# Altium project Yukitora.PrjPcb (part 4 of 5)

## Sheet Bluetooth.SchDoc
size Tabloid; Organization: Altium Limited; Address1: L3, 12a Rodborough Rd; Address2: Frenchs Forest; Address3: NSW; Address4: Australia 2086
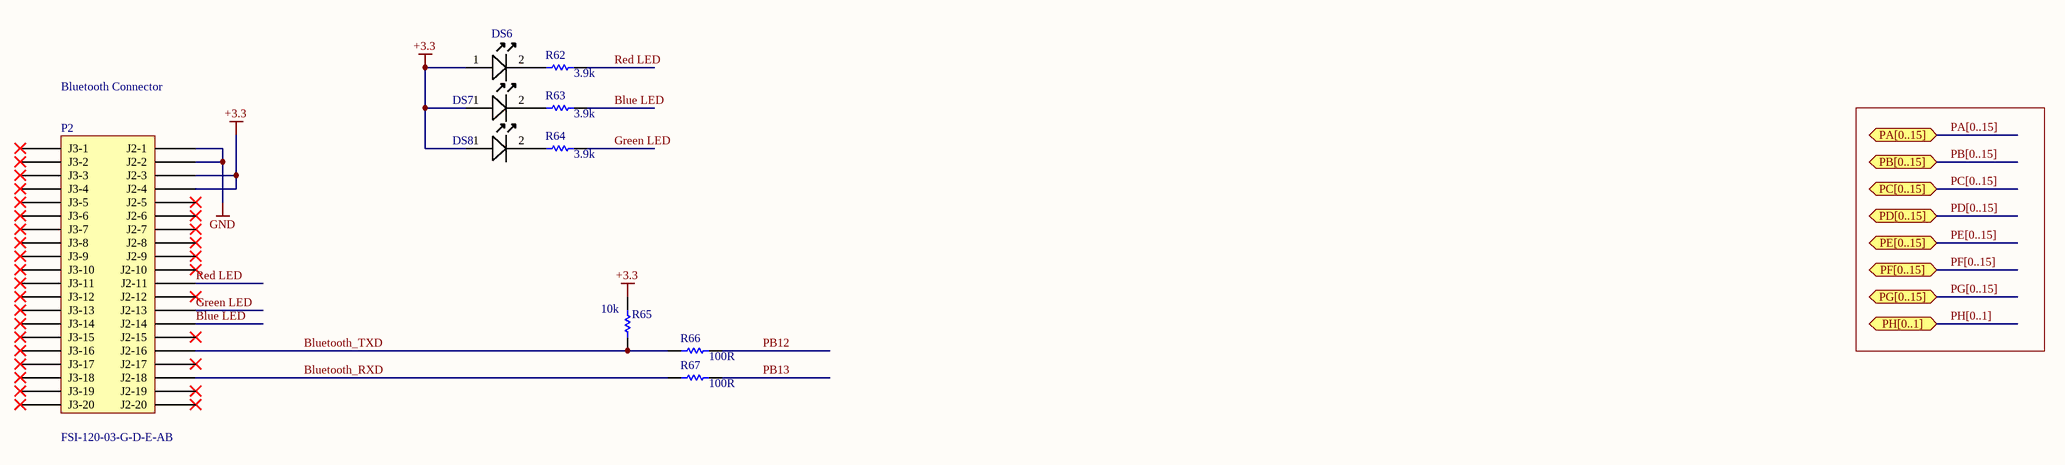
[diagram p8: Bluetooth.SchDoc]

### Parts
DS6  Lite-On LTST-S220KGKT Green LED, 571 nm 2012 (0805) Side View, Rectangle Lens SMD package  [0805C_L]  (value not drawn)
DS7  Lite-On LTST-S220KGKT Green LED, 571 nm 2012 (0805) Side View, Rectangle Lens SMD package  [0805C_L]  (value not drawn)
DS8  Lite-On LTST-S220KGKT Green LED, 571 nm 2012 (0805) Side View, Rectangle Lens SMD package  [0805C_L]  (value not drawn)
P2  FSI-120-03-G-D-E-AB  [FSI-120-03-G-D-E-AB]
R62  Resistance: 3.9k  [RESC0805(2012)_M]  (hidden comment: CRCW08053K90FKEA)
R63  Resistance: 3.9k  [RESC0805(2012)_M]  (hidden comment: CRCW08053K90FKEA)
R64  Resistance: 3.9k  [RESC0805(2012)_M]  (hidden comment: CRCW08053K90FKEA)
R65  Resistance: 10k  [RESC2013X50X30NL20T20]  (hidden comment: CRCW080510K0FKEA)
R66  Resistance: 100R  [RESC2013X50X30LL20T20]  (hidden comment: CRCW0805100RFKEA)
R67  Resistance: 100R  [RESC2013X50X30LL20T20]  (hidden comment: CRCW0805100RFKEA)

### Ports
PA[0..15] (bidir), PB[0..15] (bidir), PC[0..15] (bidir), PD[0..15] (bidir), PE[0..15] (bidir), PF[0..15] (bidir), PG[0..15] (bidir), PH[0..1] (bidir)

### Nets
+3.3: DS6.1(A) DS7.1(A) DS8.1(A) P2.J2-3 P2.J2-4 R65.2
GND: P2.J2-1 P2.J2-2
Blue LED: P2.J2-14 R63.2
Bluetooth_RXD: P2.J2-18 R67.1
Bluetooth_TXD: P2.J2-16 R65.1 R66.1
Green LED: P2.J2-13 R64.2
PB12: R66.2
PB13: R67.2
Red LED: P2.J2-11 R62.2
NetDS6_2: DS6.2(K) R62.1
NetDS7_2: DS7.2(K) R63.1
NetDS8_2: DS8.2(K) R64.1

Not connected (* = marked no-connect by the designer): P2 J2-5* J2-6* J2-7* J2-8* J2-9* J2-10* J2-12* J2-15* J2-17* J2-19* J2-20* J3-1* J3-2* J3-3* J3-4* J3-5* J3-6* J3-7* J3-8* J3-9* J3-10* J3-11* J3-12* J3-13* J3-14* J3-15* J3-16* J3-17* J3-18* J3-19* J3-20*

### Buses and harness runs
bus PA[0..15] = port PA[0..15]
bus PB[0..15] = port PB[0..15]
bus PC[0..15] = port PC[0..15]
bus PD[0..15] = port PD[0..15]
bus PE[0..15] = port PE[0..15]
bus PF[0..15] = port PF[0..15]
bus PG[0..15] = port PG[0..15]
bus PH[0..1] = port PH[0..1]

### Notes on the sheet
- Bluetooth Connector
- Title
- Size:
- Date:
- Tabloid
- Number:
- Time:
- Revision:
- Sheet
- of
- File:

### Library data of the parts
DS6-DS8 = LED A/K: Manufacturer: Vishay / Lite-On; Lens Colour: Colorless; Viewing Angle: 130°; Luminous Intensity: 35mcd; Forward Current: 20mA; Forward Voltage: 2V; Lens Style: Diffused,Colorless; Power Rating: 75mW; Dominant Wavelength: 568nm; Lens Transparency: Clear; Number of Elements: 1; Power Dissipation: 75W; Wavelength: 574nm; Supplier 1: Digi-Key; Supplier Part Number 1: 160-1468-1-ND; Manufacturer Part Number: LTST-S220KGKT; Stock 1: 74800; Pricing 1: 1=0.29, 10=0.212, 25=0.1564, 100=0.1117, 250=0.0759, 500=0.067, 1000=0.0525 (USD); Mount: Surface Mount; Case/Package: 0805; Number of Pins: 2; Colour: Green; Case Code (Metric): 2012; Case Code (Imperial): 0805; Min Operating Temperature: -55°C; Max Operating Temperature: 85°C; Packaging: Tape and Reel; Package Quantity: 4000; Illumination Colour: Green; Test Current: 20mA; Number of LEDs: 1; Length: 2.1mm; Height: 0.6mm; Width: 1mm; Depth: 0.6mm; Radiation Hardening: No; Lead Free: Lead Free; ComponentLink1URL: https://datasheet.ciiva.com/11775/0900766b80dc0b70-11775441.pdf; ComponentLink1Description: https://datasheet.ciiva.com/11775/0900766b80dc0b70-11775441.pdf; ComponentLink2URL: https://datasheet.ciiva.com/2110/s-110-ltst-s220kgkt-2110069.pdf; ComponentLink2Description: https://datasheet.ciiva.com/2110/s-110-ltst-s220kgkt-2110069.pdf; ComponentLink3URL: https://datasheet.ciiva.com/2110/s-110-ltst-s220kgkt-2110070.pdf; ComponentLink3Description: https://datasheet.ciiva.com/2110/s-110-ltst-s220kgkt-2110070.pdf; ComponentLink4URL: https://datasheet.ciiva.com/12400/100-ltst-s220kgkt-59602-12400886.pdf; ComponentLink4Description: https://datasheet.ciiva.com/12400/100-ltst-s220kgkt-59602-12400886.pdf; ComponentLink5URL: https://datasheet.ciiva.com/2110/s-110-ltst-s220kgkt-2110071.pdf; ComponentLink5Description: https://datasheet.ciiva.com/2110/s-110-ltst-s220kgkt-2110071.pdf; ComponentLink6URL: https://datasheet.ciiva.com/16379/ltst-s220kgkt-16379082.pdf; ComponentLink6Description: https://datasheet.ciiva.com/16379/ltst-s220kgkt-16379082.pdf; Supplier 2: Farnell; Supplier Part Number 2: 2062310; RoHS: YES; Stock 2: 2271; Pricing 2: 1=0.325, 10=0.317, 100=0.23, 200=0.228, 400=0.182, 900=0.147, 3000=0.114, 9000=0.107 (GBP); ComponentLink7URL: http://www.farnell.com/cad/2124774.pdf; ComponentLink7Description: http://www.farnell.com/cad/2124774.pdf; ComponentLink8URL: http://www.farnell.com/datasheets/693084.pdf; ComponentLink8Description: http://www.farnell.com/datasheets/693084.pdf
P2 = FSI-120-03-G-D-E-AB: Manufacturer: Samtec; Number of Contacts: 40; Gender: Male; Max Current Rating: 1A; Pitch: 1mm; Supplier 1: Avnet; Supplier Part Number 1: FSI-120-03-G-D-E-AB; Supplier 2: Newark; Supplier Part Number 2: 39AC0344; Manufacturer Part Number: FSI-120-03-G-D-E-AB; Stock 2: 100; Pricing 2: 1=9.64000, 10=9.22000, 100=7.76000, 500=6.50000, 1000=5.74000 (USD); RoHS: Yes; Contact Plating: Gold; Contact Material: Copper; Housing Material: Polymer; Min Operating Temperature: -55°C; Max Operating Temperature: 125°C; Number of Rows: 2; Termination: Solder; Packaging: Rail/Tube; Orientation: Straight; Length: 34.1mm; Depth: 8.76mm; ComponentLink1URL: https://datasheet.ciiva.com/9801/fsi-03-9801254.pdf?src-supplier=Avnet; ComponentLink1Description: https://datasheet.ciiva.com/9801/fsi-03-9801254.pdf?src-supplier=Avnet
R62-R64 = CMP-1013-00576-1: 3.9 kOhms ±1% 0.125W, 1/8W Chip Resistor 0805 (2012 Metric) Automotive AEC-Q200 Thick Film; Manufacturer: Vishay; Value: 3900.00 Ohm; Case-Metric: 2012; Case-EIA: 0805; Temperature Coefficient: 100ppm/°C; Power Rating: 125mW; Voltage Rating: 150V; Power: 0.125 W; Tolerance: 1 %; Technology: SMT; Supplier 1: Digi-Key; Supplier Part Number 1: 541-3.90KCCT-ND; Manufacturer Part Number: CRCW08053K90FKEA; Stock 1: 26580; Pricing 1: 1=0.10000, 10=0.06600, 100=0.02670, 1000=0.01199, 2500=0.01041 (USD); RoHS: Yes; Mount: Surface Mount; Case/Package: 0805; Weight: 0.000194oz; Case Code (Imperial): 0805; Case Code (Metric): 2012; Contact Plating: Tin; Min Operating Temperature: -55°C; Max Operating Temperature: 155°C; Packaging: Tape and Reel; Composition: Thick Film; Voltage Rating (DC): 150V; Termination: SMD/SMT; Military Standard: Not; Package Quantity: 5000; Length: 2mm; Height: 0.45mm; Width: 1.25mm; Depth: 1.25mm; Radiation Hardening: No; REACH SVHC: Unknown; Lead Free: Lead Free; ComponentLink1URL: https://datasheet.ciiva.com/11809/0900766b80d98b26-11809706.pdf?src-supplier=RSComponents; ComponentLink1Description: https://datasheet.ciiva.com/11809/0900766b80d98b26-11809706.pdf?src-supplier=RSComponents; ComponentLink2URL: https://datasheet.ciiva.com/26312/fld-crcw-e3-data-en-26312936.pdf?src-supplier=Distrelec; ComponentLink2Description: https://datasheet.ciiva.com/26312/fld-crcw-e3-data-en-26312936.pdf?src-supplier=Distrelec; ComponentLink3URL: https://datasheet.ciiva.com/16514/dcrcwe3-16514665.pdf?src-supplier=Avnet+Asia; ComponentLink3Description: https://datasheet.ciiva.com/16514/dcrcwe3-16514665.pdf?src-supplier=Avnet+Asia; ComponentLink4URL: https://datasheet.ciiva.com/7841/1697337-7841674.pdf?src-supplier=Element14; ComponentLink4Description: https://datasheet.ciiva.com/7841/1697337-7841674.pdf?src-supplier=Element14; ComponentLink5URL: https://datasheet.ciiva.com/16200/dcrcwe3-16200122.pdf?src-supplier=Future+Electronics; ComponentLink5Description: https://datasheet.ciiva.com/16200/dcrcwe3-16200122.pdf?src-supplier=Future+Electronics; ComponentLink6URL: https://datasheet.ciiva.com/16771/70201119-16771131.pdf?src-supplier=Allied+Electronics; ComponentLink6Description: https://datasheet.ciiva.com/16771/70201119-16771131.pdf?src-supplier=Allied+Electronics; ComponentLink7URL: https://datasheet.ciiva.com/5550/dcrcwe3-109170-5550716.pdf?src-supplier=Mouser; ComponentLink7Description: https://datasheet.ciiva.com/5550/dcrcwe3-109170-5550716.pdf?src-supplier=Mouser; ComponentLink8URL: https://datasheet.ciiva.com/9076/dcrcwe3-9076428.pdf?src-supplier=Avnet; ComponentLink8Description: https://datasheet.ciiva.com/9076/dcrcwe3-9076428.pdf?src-supplier=Avnet; ComponentLink9URL: https://datasheet.ciiva.com/7841/1533075-7841853.pdf?src-supplier=Element14; ComponentLink9Description: https://datasheet.ciiva.com/7841/1533075-7841853.pdf?src-supplier=Element14
R65 = CMP-2001-04908-1: 10 kOhms ±1% 0.125W, 1/8W Chip Resistor 0805 (2012 Metric) Automotive AEC-Q200 Thick Film; Manufacturer: Vishay Dale; Temperature Coefficient: 100ppm/°C; Power Rating: 125mW; Voltage Rating: 150V; Part Number: CRCW080510K0FKEA; Supplier 1: Digi-Key; Supplier Part Number 1: 541-10.0KCCT-ND; Manufacturer Part Number: CRCW080510K0FKEA; Stock 1: 1421317; Pricing 1: 1=0.10000, 10=0.06600, 100=0.02670, 1000=0.01199, 2500=0.01041 (USD); RoHS: Yes; Case/Package: 0805; Weight: 0.000194oz; Contact Plating: Tin; Case Code (Imperial): 0805; Case Code (Metric): 2012; Min Operating Temperature: -55°C; Max Operating Temperature: 155°C; Tolerance: 1%; Composition: Thick Film; Packaging: Tape and Reel; Package Quantity: 5000; Military Standard: Not; Termination: SMD/SMT; Voltage Rating (DC): 150V; Length: 2mm; Height: 0.45mm; Width: 1.25mm; Depth: 1.25mm; Radiation Hardening: No; Lead Free: Lead Free; REACH SVHC: Unknown; ComponentLink1URL: https://datasheet.ciiva.com/11808/0900766b80d98b26-11808216.pdf?src-supplier=RSComponents; ComponentLink1Description: https://datasheet.ciiva.com/11808/0900766b80d98b26-11808216.pdf?src-supplier=RSComponents; ComponentLink2URL: https://datasheet.ciiva.com/5547/dcrcwe3-109170-5547559.pdf?src-supplier=Mouser; ComponentLink2Description: https://datasheet.ciiva.com/5547/dcrcwe3-109170-5547559.pdf?src-supplier=Mouser; ComponentLink3URL: https://datasheet.ciiva.com/16719/70201119-16719082.pdf?src-supplier=Allied+Electronics; ComponentLink3Description: https://datasheet.ciiva.com/16719/70201119-16719082.pdf?src-supplier=Allied+Electronics; ComponentLink4URL: https://datasheet.ciiva.com/16514/dcrcwe3-16514907.pdf?src-supplier=Avnet+Asia; ComponentLink4Description: https://datasheet.ciiva.com/16514/dcrcwe3-16514907.pdf?src-supplier=Avnet+Asia; ComponentLink5URL: https://datasheet.ciiva.com/16883/dcrcwe3-16883708.pdf?src-supplier=Avnet+Europe; ComponentLink5Description: https://datasheet.ciiva.com/16883/dcrcwe3-16883708.pdf?src-supplier=Avnet+Europe; ComponentLink6URL: https://datasheet.ciiva.com/8337/dcrcwe3-8337773.pdf?src-supplier=Avnet; ComponentLink6Description: https://datasheet.ciiva.com/8337/dcrcwe3-8337773.pdf?src-supplier=Avnet; ComponentLink7URL: https://datasheet.ciiva.com/16755/70201119-16755389.pdf?src-supplier=Allied+Electronics; ComponentLink7Description: https://datasheet.ciiva.com/16755/70201119-16755389.pdf?src-supplier=Allied+Electronics; ComponentLink8URL: https://datasheet.ciiva.com/46394/1720486-46394381.pdf?src-supplier=Element14; ComponentLink8Description: https://datasheet.ciiva.com/46394/1720486-46394381.pdf?src-supplier=Element14; ComponentLink9URL: https://datasheet.ciiva.com/8337/dcrcwe3-8337774.pdf?src-supplier=Avnet; ComponentLink9Description: https://datasheet.ciiva.com/8337/dcrcwe3-8337774.pdf?src-supplier=Avnet; ComponentLink10URL: https://datasheet.ciiva.com/16199/dcrcwe3-16199086.pdf?src-supplier=Future+Electronics; ComponentLink10Description: https://datasheet.ciiva.com/16199/dcrcwe3-16199086.pdf?src-supplier=Future+Electronics
R66 R67 = CMP-2001-04901-1: 100 Ohms ±1% 0.125W, 1/8W Chip Resistor 0805 (2012 Metric) Thick Film; Manufacturer: Vishay Dale; Power Rating: 125mW; Temperature Coefficient: 100ppm/°C; Voltage Rating: 150V; Part Number: CRCW0805100RFKEA; Supplier 1: Future Electronics; Supplier Part Number 1: CRCW0805100RFKEA-REEL; Manufacturer Part Number: CRCW0805100RFKEA; Stock 1: 460000; Pricing 1: 5000=0.00740, 10000=0.00400, 25000=0.00370, 50000=0.00350, 125000=0.00330 (USD); RoHS: Yes; Mount: Surface Mount; Case/Package: 0805; Number of Pins: 2; Weight: 0.000194oz; Contact Plating: Tin; Case Code (Metric): 2012; Case Code (Imperial): 0805; Min Operating Temperature: -55°C; Max Operating Temperature: 155°C; Tolerance: 1%; Composition: Thick Film; Package Quantity: 10; Packaging: Tape and Reel; Termination: SMD/SMT; Military Standard: Not; Voltage Rating (DC): 150V; Number of Terminations: 2; Max Power Dissipation: 125mW; Features: Automotive AEC-Q200; Length: 2mm; Height: 0.45mm; Width: 0.049inch; Depth: 1.25mm; Radiation Hardening: No; Lead Free: Lead Free; REACH SVHC: Unknown; ComponentLink1URL: https://datasheet.ciiva.com/11809/0900766b80d98b26-11809126.pdf?src-supplier=RSComponents; ComponentLink1Description: https://datasheet.ciiva.com/11809/0900766b80d98b26-11809126.pdf?src-supplier=RSComponents; ComponentLink2URL: https://datasheet.ciiva.com/2495/dcrcwe3-2495842.pdf?src-supplier=Digi-Key; ComponentLink2Description: https://datasheet.ciiva.com/2495/dcrcwe3-2495842.pdf?src-supplier=Digi-Key; ComponentLink3URL: https://datasheet.ciiva.com/2495/dcrcwe3-2495843.pdf?src-supplier=Digi-Key; ComponentLink3Description: https://datasheet.ciiva.com/2495/dcrcwe3-2495843.pdf?src-supplier=Digi-Key; ComponentLink4URL: https://datasheet.ciiva.com/2495/dcrcwe3-2495844.pdf?src-supplier=Digi-Key; ComponentLink4Description: https://datasheet.ciiva.com/2495/dcrcwe3-2495844.pdf?src-supplier=Digi-Key; ComponentLink5URL: https://datasheet.ciiva.com/15159/getdatasheetpartid-90825-15159895.pdf?src-supplier=Verical; ComponentLink5Description: https://datasheet.ciiva.com/15159/getdatasheetpartid-90825-15159895.pdf?src-supplier=Verical; ComponentLink6URL: https://datasheet.ciiva.com/16514/dcrcwe3-16514904.pdf?src-supplier=Avnet+Asia; ComponentLink6Description: https://datasheet.ciiva.com/16514/dcrcwe3-16514904.pdf?src-supplier=Avnet+Asia; ComponentLink7URL: https://datasheet.ciiva.com/8337/dcrcwe3-8337753.pdf?src-supplier=Avnet; ComponentLink7Description: https://datasheet.ciiva.com/8337/dcrcwe3-8337753.pdf?src-supplier=Avnet; ComponentLink8URL: https://datasheet.ciiva.com/16777/70201119-16777129.pdf?src-supplier=Allied+Electronics; ComponentLink8Description: https://datasheet.ciiva.com/16777/70201119-16777129.pdf?src-supplier=Allied+Electronics; ComponentLink9URL: https://datasheet.ciiva.com/3258/dcrcwe3-3258011.pdf?src-supplier=Avnet; ComponentLink9Description: https://datasheet.ciiva.com/3258/dcrcwe3-3258011.pdf?src-supplier=Avnet; ComponentLink10URL: https://datasheet.ciiva.com/5546/dcrcwe3-109170-5546700.pdf?src-supplier=Mouser; ComponentLink10Description: https://datasheet.ciiva.com/5546/dcrcwe3-109170-5546700.pdf?src-supplier=Mouser; ComponentLink11URL: https://datasheet.ciiva.com/16760/70201119-16760940.pdf?src-supplier=Allied+Electronics; ComponentLink11Description: https://datasheet.ciiva.com/16760/70201119-16760940.pdf?src-supplier=Allied+Electronics

## Sheet Power.SchDoc
size Tabloid; Organization: Altium Limited; Address1: L3, 12a Rodborough Rd; Address2: Frenchs Forest; Address3: NSW; Address4: Australia 2086
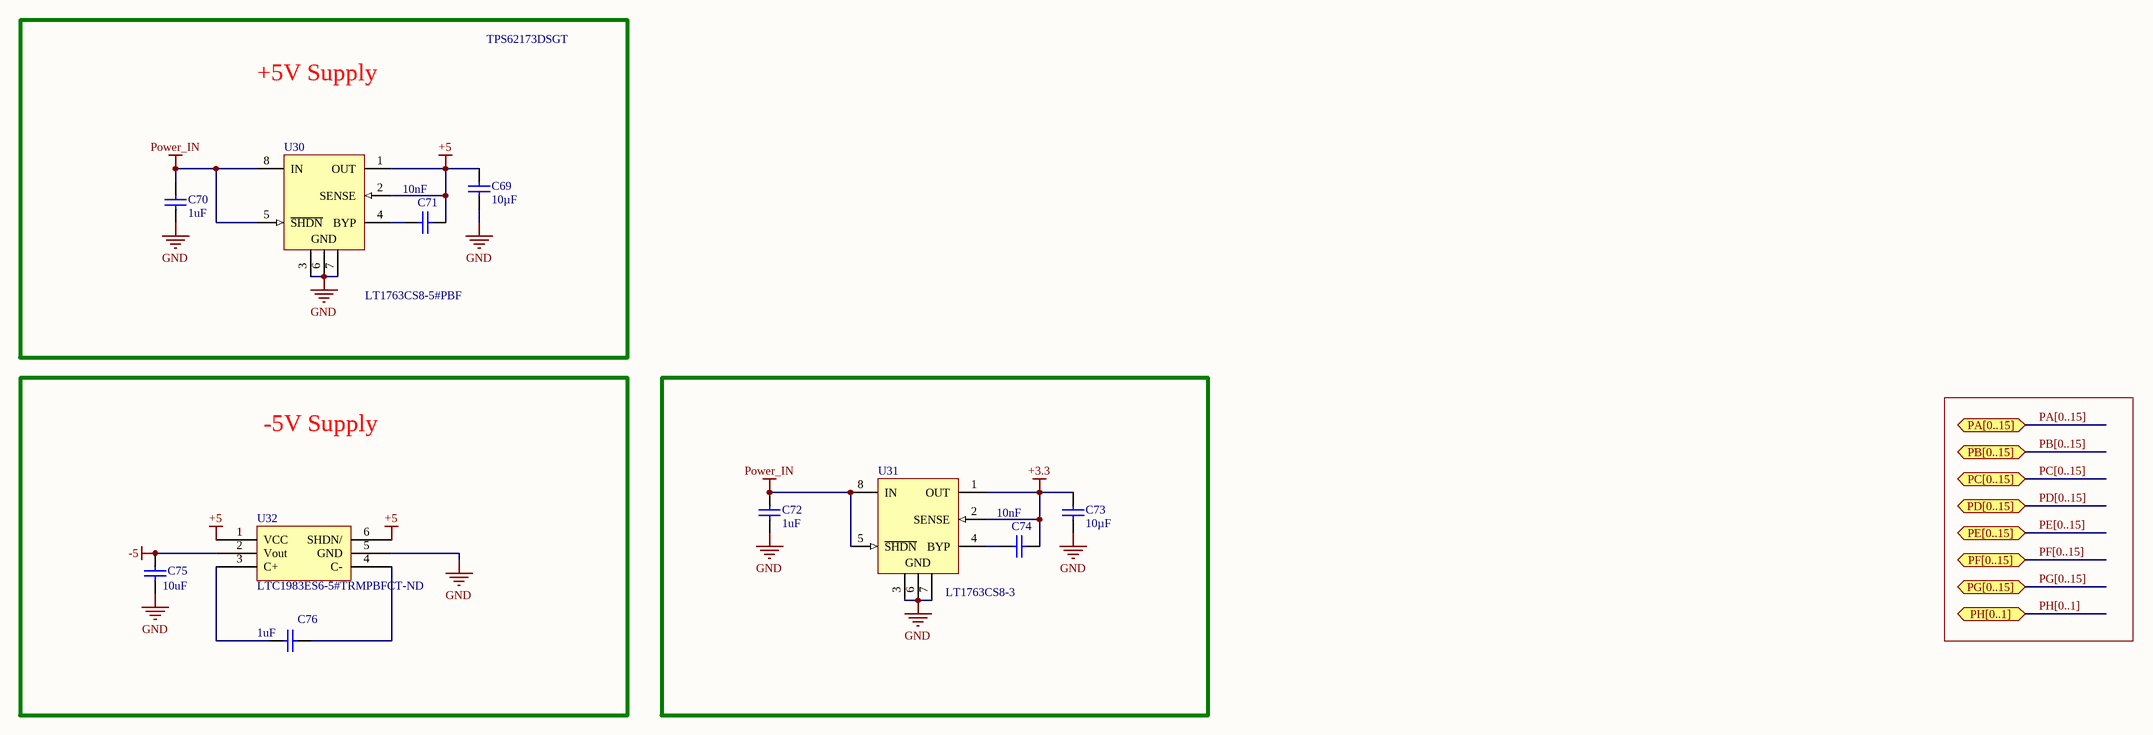
[diagram p9: Power.SchDoc]

### Parts
C69  Capacity (elec.): 10µF  [CAPC3216X180X55LL20T25]  (hidden comment: GRM31CR71C106KA12L)
C70  Capacitance: 1uF  [CAPC3216X110X50LL20T25]  (hidden comment: C1206C105K5RACTU)
C71  value 10nF  [CAPC1206(3216)110_L]  (hidden comment: CAP 10nF 16V 1206(3216))
C72  Capacitance: 1uF  [CAPC3216X110X50LL20T25]  (hidden comment: C1206C105K5RACTU)
C73  Capacity (elec.): 10µF  [CAPC3216X180X55LL20T25]  (hidden comment: GRM31CR71C106KA12L)
C74  value 10nF  [CAPC1206(3216)110_L]  (hidden comment: CAP 10nF 16V 1206(3216))
C75  Capacitance: 10uF  [CAPC1206(3216)130_N]  (hidden comment: JMK316BJ106ML-T)
C76  Capacitance: 1uF  [CAPC3216X110X50LL20T25]  (hidden comment: C1206C105K5RACTU)
U30  LT1763CS8-5#PBF  [LT-S8-8_M]
U31  LT1763CS8-3  [LT-S8-8_L]
U32  Supplier Part Number 1: LTC1983ES6-5#TRMPBFCT-ND  [SOT95P323X100-6N]  (hidden comment: LTC1983ES6-5#TRMPBF)

### Blocks framed on the sheet
+5V Supply: C69-C71 U30
-5V Supply: C75 C76 U32

### Ports
PA[0..15] (bidir), PB[0..15] (bidir), PC[0..15] (bidir), PD[0..15] (bidir), PE[0..15] (bidir), PF[0..15] (bidir), PG[0..15] (bidir), PH[0..1] (bidir)

### Nets
+3.3: C73.2 C74.2 U31.1(OUT) U31.2(SENSE)
+5: C69.2 C71.2 U30.1(OUT) U30.2(SENSE) U32.1(VCC) U32.6(SHDN/)
-5: C75.2 U32.2(Vout)
GND: C69.1 C70.1 C72.1 C73.1 C75.1 U30.3(GND) U30.6(GND) U30.7(GND) U31.3(GND) U31.6(GND) U31.7(GND) U32.5(GND)
Power_IN: C70.2 C72.2 U30.5(~{SHDN}) U30.8(IN) U31.5(~{SHDN}) U31.8(IN)
NetC71_1: C71.1 U30.4(BYP)
NetC74_1: C74.1 U31.4(BYP)
NetC76_1: C76.1 U32.3(C+)
NetC76_2: C76.2 U32.4(C-)

### Buses and harness runs
bus PA[0..15] = port PA[0..15]
bus PB[0..15] = port PB[0..15]
bus PC[0..15] = port PC[0..15]
bus PD[0..15] = port PD[0..15]
bus PE[0..15] = port PE[0..15]
bus PF[0..15] = port PF[0..15]
bus PG[0..15] = port PG[0..15]
bus PH[0..1] = port PH[0..1]

### Notes on the sheet
- TPS62173DSGT
- Title
- Size:
- Date:
- Tabloid
- Number:
- Time:
- Revision:
- Sheet
- of
- File:

### Library data of the parts
C69 C73 = CMP-2000-06351-1: Chip Capacitor, 10 uF, +/- 10%, 16 V, -55 to 125 degC, 1206 (3216 Metric), RoHS, Tape and Reel; Manufacturer: Murata; Type: SMD; Content: 1pc(s); Nominal voltage: 16V; Material properties: X7R; Material: Ceramic; Package Description: 2-Pin Surface Mount Device, Body 3.2 x 1.6 mm; Mounting Technology: SurfaceMount; Tolerance: 10%; Datasheet URL: http://psearch.en.murata.com/capacitor/product/GRM31CR71C106KA12%23.pdf; Package Reference: 1206; Manufacturer URL: http://www.murata.com/; Category: Ceramiccapacitor; Datasheet Version: 10/2016
C70 C72 C76 = CMP-2000-06011-1: Chip Capacitor, 1 uF, +/- 10%, 50 V, -55 to 125 degC, 1206 (3216 Metric), RoHS, Tape and Reel; Manufacturer: Kemet; Case Height: 1mm; Dielectric: X7R; Voltage Rating: 50V; Temperature Coefficient / Code: +/-15%; Case Length: 3.2mm; Case Width: 1.6mm; Type: SMDMLCCX7R6.3-250VDCCommericalGrade; Class: Class1; Capacitance - nF: 1000nF; Datasheet URL: http://www.kemet.com/docfinder?Partnumber=C1206C105K5RACTU; Product Category: MultilayerCeramicCapacitorsMLCC-SMD/SMT; Termination Style: SMD/SMT; Dimensions: 1.6mmWx3.2mmLx1mmH; Voltage Rating DC: 50V; Datasheet Version: 02/2016; Packaging: Reel; Brand: Kemet; RoHS: Details; Minimum Operating Temperature: -55C; Operating Temperature Range: -55Cto+125C; Package Reference: 1206; Manufacturer URL: http://www.kemet.com/; Product: GeneralTypeMLCCs; Tolerance: 10%; Package Description: 2-Pin Surface Mount Device, Body 3.2 x 1.6 mm; Mounting Technology: SurfaceMount; Case Code - mm: 3216; Maximum Operating Temperature: +125C; Series: C1206C; Factory Pack Quantity: 2500; Package / Case: 1206(3216metric); Case Code - in: 1206
C71 C74 = CMP-1037-03470-1: CAP 10nF 16V ±10% 1206 (3216 Metric) Thickness 1.1mm SMD; Case-Metric: 3216; Tolerance: Â±10%; Case-EIA: 1206; Technology: SMT; Max Thickness: 1.1 mm; Rated Voltage: 16 V
C75 = CMP-1037-04913-1: 10µF ±20% 6.3V Ceramic Capacitor X5R 1206 (3216 Metric); Manufacturer: Taiyo Yuden; Notification: Current market demand for these product types have resulted in fluctuating and extending lead times. Lead times may differ.; Supplier 1: Digi-Key; Supplier Part Number 1: 587-5447-1-ND; Manufacturer Part Number: JMK316BJ106ML-T; RoHS: RoHS Compliant; Category: Capacitors; Stock 1: 5600; Pricing 1: 1=0.24, 10=0.161, 100=0.0817, 500=0.05592, 1000=0.04946 (USD); Packaging: Cut Tape (CT); Part Status: Active; Tolerance: ±20%; Voltage - Rated: 6.3V; Temperature Coefficient: X5R; Operating Temperature: -55°C ~ 85°C; Features: -; Ratings: -; Applications: SMPS Filtering; Failure Rate: -; Mounting Type: Surface Mount, MLCC; Package / Case: 1206 (3216 Metric); Size / Dimension: 0.126" L x 0.063" W (3.20mm x 1.60mm); Height - Seated (Max): -; Thickness (Max): 0.071" (1.80mm); Lead Spacing: -; Lead Style: -; ComponentLink1URL: http://ds.yuden.co.jp/TYCOMPAS/ut/detail.do?productNo=JMK316BJ106ML-T&fileName=JMK316BJ106ML-T_SS&mode=specSheetDownload; ComponentLink1Description: http://ds.yuden.co.jp/TYCOMPAS/ut/detail.do?productNo=JMK316BJ106ML-T&fileName=JMK316BJ106ML-T_SS&mode=specSheetDownload
U30 = CMP-0476-01685-1: 500 mA, Low Noise, LDO Micropower Regulator, 1.8 to 20 V Vin, 5 V Vout, 8-pin SOIC (S8-8), -40 to 125 degC, Pb-Free; Manufacturer: Linear Technology; Output Voltage: 5 V; Vin Min(V): 1.8; Discrete Pass Element: no; Number of Outputs: 1; Dropout Voltage(V): 0.3; Vin Max(V): 20; PSRR(dB): 65; Iout(mA): 500; Isupply(mA): 0.03; Mounting Technology: Surface Mount; ComponentLink3Description: Package Specification; PartNumber: LT1763CS8-5#PBF; PackageDescription: 8-Pin Plastic Small Outline (Narrow .150 Inch), Body 4.9 x 3.9 mm, Pitch 1.27 mm; DatasheetVersion: Rev. G; ComponentLink2URL: http://cds.linear.com/docs/en/datasheet/1763fg.pdf; PackageReference: S8-8; ComponentLink1URL: http://www.linear.com/; ComponentLink2Description: Datasheet; ComponentLink1Description: Manufacturer URL; PackageVersion: Rev. G, 03/2012; Shutdown Current(uA): 1; ComponentLink3URL: http://cds.linear.com/docs/en/packaging/05081610_G_SO8.pdf; RoHS: TRUE; Noise(uV): 20
U31 = CMP-0476-01667-1: 500 mA, Low Noise, LDO Micropower Regulator, 1.8 to 20 V Vin, 3 V Vout, 8-pin SOIC (S8-8), -40 to 125 degC; Manufacturer: Linear Technology; Shutdown Current(uA): 1; Discrete Pass Element: no; Iout(mA): 500; PSRR(dB): 65; Vin Min(V): 1.8; Output Voltage: 3 V; Vin Max(V): 20; Dropout Voltage(V): 0.3; Isupply(mA): 0.03; PartNumber: LT1763CS8-3; ComponentLink1URL: http://www.linear.com/; PackageDescription: 8-Pin Plastic Small Outline (Narrow .150 Inch), Body 4.9 x 3.9 mm, Pitch 1.27 mm; Mounting Technology: Surface Mount; ComponentLink2Description: Datasheet; Noise(uV): 20; ComponentLink1Description: Manufacturer URL; ComponentLink3Description: Package Specification; RoHS: FALSE; PackageVersion: Rev. G, 03/2012; DatasheetVersion: Rev. G; ComponentLink2URL: http://cds.linear.com/docs/en/datasheet/1763fg.pdf; ComponentLink3URL: http://cds.linear.com/docs/en/packaging/05081610_G_SO8.pdf; Number of Outputs: 1; PackageReference: S8-8
U32 = LTC1983ES6-5#TRMPBF: Charge Pump Switching Regulator IC Negative Fixed -5V 1 Output 100mA SOT-23-6 Thin, TSOT-23-6; Manufacturer: Linear Technology/Analog Devices; Function: Step-Down; Number of Outputs: 1; Voltage - Input (Min): 2.3V; Voltage - Input (Max): 5.5V; Frequency - Switching: 900kHz; Synchronous Rectifier: No; Supplier 1: Digi-Key; Manufacturer Part Number: LTC1983ES6-5#TRMPBF; RoHS: RoHS Compliant; Category: Integrated Circuits (ICs); Stock 1: 17516; Pricing 1: 1=4.36, 25=3.8952, 100=2.3256, 250=2.1318 (USD); Packaging: Cut Tape (CT); Part Status: Active; Output Configuration: Negative; Topology: Charge Pump; Output Type: Fixed; Voltage - Output (Min/Fixed): -5V; Voltage - Output (Max): -; Current - Output: 100mA; Operating Temperature: -40°C ~ 85°C (TA); Mounting Type: Surface Mount; Package / Case: SOT-23-6 Thin, TSOT-23-6; Supplier Device Package: TSOT-23-6; Base Part Number: LTC1983-5; ComponentLink1URL: http://www.linear.com/docs/2135; ComponentLink1Description: http://www.linear.com/docs/2135

## Sheet Force_Plates_Power_Supply.SchDoc
size OrCAD A; Organization: Altium Limited; Address1: L3, 12a Rodborough Rd; Address2: Frenchs Forest; Address3: NSW; Address4: Australia 2086
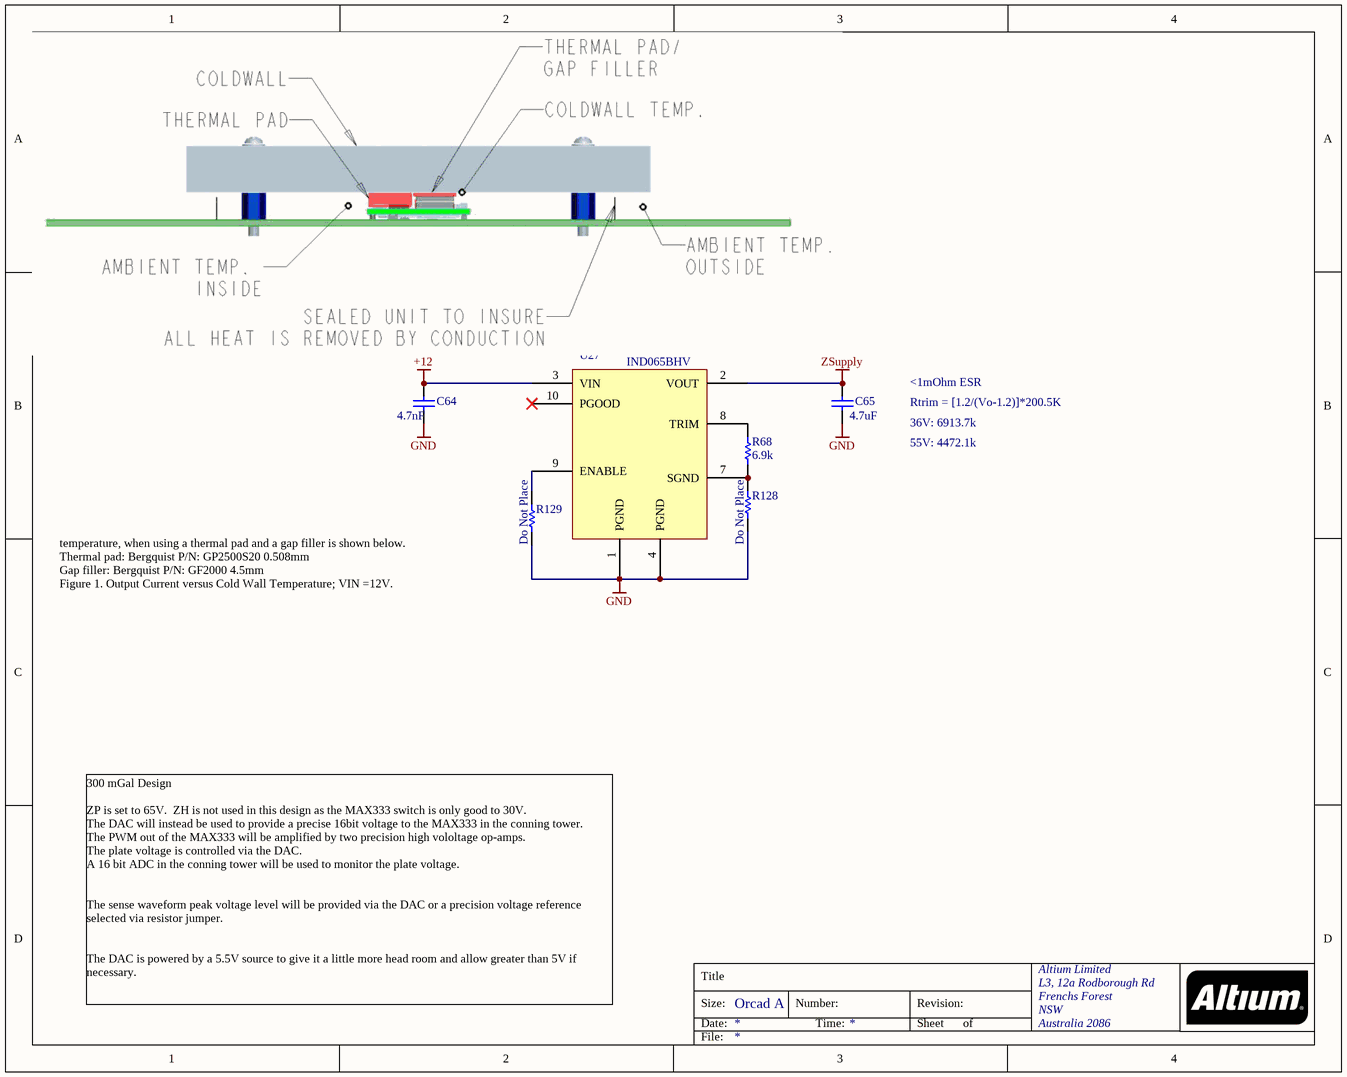
[diagram p10: Force_Plates_Power_Supply.SchDoc]

### Parts
C64  Capacitance: 4.7nF  [CAPC0805(2012)155_L]  (hidden comment: C1206C472K1RECAUTO)
C65  Capacitance: 4.7uF  [CAPC1210(3225)130_M]  (hidden comment: C1206C472K1RECAUTO)
R68  6.9k  [RESC0805(2012)_L]
R128  Do Not Place  [RESC0805(2012)_L]
R129  Do Not Place  [RESC0805(2012)_L]
U27  IND065BHV  [IND065BHV]

### Nets
+12: C64.2 U27.3(VIN)
GND: C64.1 C65.1 R128.2 R129.2 U27.1(PGND) U27.4(PGND)
ZSupply: C65.2 U27.2(VOUT)
NetR68_1: R68.1 U27.8(TRIM)
NetR68_2: R68.2 R128.1 U27.7(SGND)
NetR129_1: R129.1 U27.9(ENABLE)

Not connected (* = marked no-connect by the designer): U27 10(PGOOD)*

### Notes on the sheet
- <1mOhm ESR
- Rtrim = [1.2/(Vo-1.2)]*200.5K
- 36V: 6913.7k
- 55V: 4472.1k
- temperature, when using a thermal pad and a gap filler is shown below.
  Thermal pad: Bergquist P/N: GP2500S20 0.508mm
  Gap filler: Bergquist P/N: GF2000 4.5mm
  Figure 1. Output Current versus Cold Wall Temperature; VIN =12V.
- 300 mGal Design
  ZP is set to 65V.  ZH is not used in this design as the MAX333 switch is only good to 30V.
  The DAC will instead be used to provide a precise 16bit voltage to the MAX333 in the conning tower.
  The PWM out of the MAX333 will be amplified by two precision high vololtage op-amps.
  The plate voltage is controlled via the DAC.
  A 16 bit ADC in the conning tower will be used to monitor the plate voltage.
  The sense waveform peak voltage level will be provided via the DAC or a precision voltage reference selected via resistor jumper.
  The DAC is powered by a 5.5V source to give it a little more head room and allow greater than 5V if necessary.
- Title
- Size:
- Date:
- Orcad A
- Number:
- Time:
- Revision:
- Sheet
- of
- File:

### Library data of the parts
C64 = CMP-1036-04882-1: 4700pF ±10% 100V Ceramic Capacitor X7R 1206 (3216 Metric); Manufacturer: KEMET; Dielectric Material: Tantalum; Voltage Rating (DC): 25V; Supplier 1: Digi-Key; Supplier Part Number 1: 399-17897-1-ND; Manufacturer Part Number: C1206C472K1RECAUTO; Stock 1: 11581; Pricing 1: 1=0.27000, 10=0.18700, 100=0.10610, 500=0.07490, 1000=0.06554 (USD); RoHS: No; ComponentLink1URL: https://api.kemet.com/component-edge/download/datasheet/C1206C472K1RECAUTO.pdf?src-supplier=Digi-Key; ComponentLink1Description: https://api.kemet.com/component-edge/download/datasheet/C1206C472K1RECAUTO.pdf?src-supplier=Digi-Key; Supplier 2: Mouser; Supplier Part Number 2: 77-VJ0805Y472KXXCBC; Stock 2: 549; Pricing 2: 1=0.44000, 10=0.44000, 50=0.35100, 100=0.26700, 1000=0.10100, 10000=0.04500 (USD); Mount: Surface Mount; Case/Package: 0805; Case Code (Imperial): 0805; Case Code (Metric): 2012; Min Operating Temperature: -55°C; Max Operating Temperature: 125°C; Tolerance: 10%; Packaging: Tape and Reel; Termination: SMD/SMT; Package Quantity: 4000; Dielectric: X7R; Length: 2mm; Height: 1.45mm; Width: 1.25mm; Depth: 1.25mm; Lead Free: Lead Free; ComponentLink2URL: https://datasheet.ciiva.com/11495/vjw1bcbascomseries-11495305.pdf?src-supplier=Avnet; ComponentLink2Description: https://datasheet.ciiva.com/11495/vjw1bcbascomseries-11495305.pdf?src-supplier=Avnet
C65 = CMP-1038-00936-1: 4700pF ±10% 100V Ceramic Capacitor X7R 1206 (3216 Metric); Manufacturer: KEMET; ComponentLink1URL: https://datasheet.ciiva.com/193/kem-c1015-x7r-ff-cap-smd-193189.pdf?src-supplier=Digi-Key; ComponentLink1Description: https://datasheet.ciiva.com/193/kem-c1015-x7r-ff-cap-smd-193189.pdf?src-supplier=Digi-Key; ComponentLink2URL: https://datasheet.ciiva.com/7807/6129-7807311.pdf?src-supplier=Element14; ComponentLink2Description: https://datasheet.ciiva.com/7807/6129-7807311.pdf?src-supplier=Element14; ComponentLink3URL: http://www.mouser.com/ds/2/212/KEM_C1013_X7R_FT-CAP_SMD-346914.pdf?src-supplier=Mouser; ComponentLink3Description: http://www.mouser.com/ds/2/212/KEM_C1013_X7R_FT-CAP_SMD-346914.pdf?src-supplier=Mouser; Supplier 1: Digi-Key; Supplier Part Number 1: 399-17897-1-ND; Manufacturer Part Number: C1206C472K1RECAUTO; Stock 1: 11581; Pricing 1: 1=0.27000, 10=0.18700, 100=0.10610, 500=0.07490, 1000=0.06554 (USD); RoHS: No; ComponentLink4URL: https://api.kemet.com/component-edge/download/datasheet/C1206C472K1RECAUTO.pdf?src-supplier=Digi-Key; ComponentLink4Description: https://api.kemet.com/component-edge/download/datasheet/C1206C472K1RECAUTO.pdf?src-supplier=Digi-Key
R68 = CMP-1013-00215-1: 6.9 kOhms ±0.1% 0.1W,0805; Manufacturer: Vishay Dale; Manufacturer Part Number: CRCW080510K0FKEA; Tolerance: ±1%; Power (Watts): 0.125W, 1/8W; Temperature Coefficient: ±100ppm/°C; Supplier 1: Digi-Key; Supplier Part Number 1: 541-10.0KCCT-ND; RoHS: RoHS Compliant; Category: Resistors; Stock 1: 1104982; Pricing 1: 1=0.1, 10=0.055, 100=0.0223, 1000=0.01003, 2500=0.0087 (USD); Packaging: Cut Tape (CT); Part Status: Active; Composition: Thick Film; Features: Automotive AEC-Q200; Operating Temperature: -55°C ~ 155°C; Package / Case: 0805 (2012 Metric); Supplier Device Package: 0805; Size / Dimension: 0.079" L x 0.049" W (2.00mm x 1.25mm); Height - Seated (Max): 0.020" (0.50mm); Failure Rate: -; ComponentLink1URL: http://www.vishay.com/docs/20035/dcrcwe3.pdf; ComponentLink1Description: http://www.vishay.com/docs/20035/dcrcwe3.pdf
R128 R129 = CMP-1013-00215-1: 0 Ohms ±0.1% 0.1W,0805; Manufacturer: Vishay Dale; Manufacturer Part Number: CRCW080510K0FKEA; Tolerance: ±1%; Power (Watts): 0.125W, 1/8W; Temperature Coefficient: ±100ppm/°C; Supplier 1: Digi-Key; Supplier Part Number 1: 541-10.0KCCT-ND; RoHS: RoHS Compliant; Category: Resistors; Stock 1: 1104982; Pricing 1: 1=0.1, 10=0.055, 100=0.0223, 1000=0.01003, 2500=0.0087 (USD); Packaging: Cut Tape (CT); Part Status: Active; Composition: Thick Film; Features: Automotive AEC-Q200; Operating Temperature: -55°C ~ 155°C; Package / Case: 0805 (2012 Metric); Supplier Device Package: 0805; Size / Dimension: 0.079" L x 0.049" W (2.00mm x 1.25mm); Height - Seated (Max): 0.020" (0.50mm); Failure Rate: -; ComponentLink1URL: http://www.vishay.com/docs/20035/dcrcwe3.pdf; ComponentLink1Description: http://www.vishay.com/docs/20035/dcrcwe3.pdf
U27 = IND065BHV: Non-Isolated PoL Module DC DC Converter 1 Output 32 ~ 54V 2A 9.6V - 14.4V Input

## Sheet Conning_Tower.SchDoc
size Tabloid; Organization: Altium Limited; Address1: L3, 12a Rodborough Rd; Address2: Frenchs Forest; Address3: NSW; Address4: Australia 2086
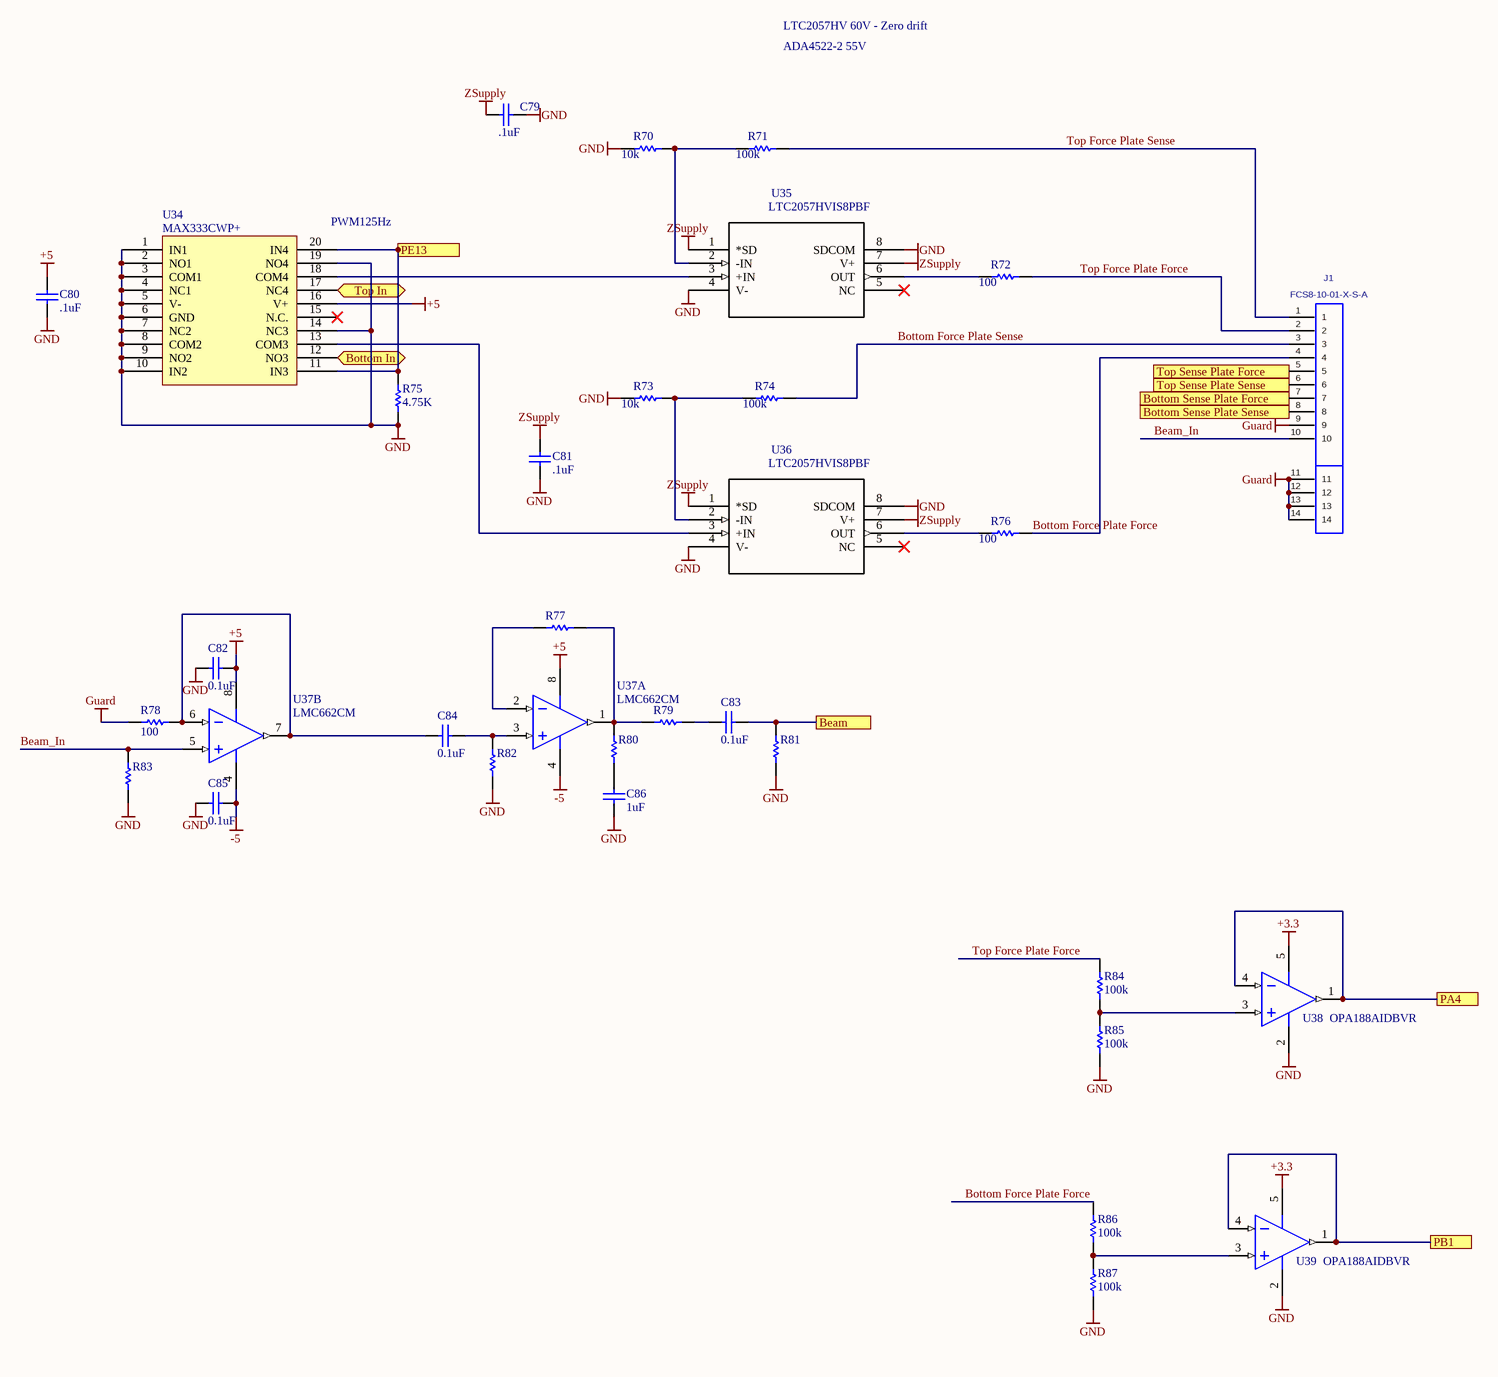
[diagram p11: Conning_Tower.SchDoc]

### Parts
C79  .1uF  [CAPC0805(2012)75_M]
C80  .1uF  [CAPC0805(2012)75_L]
C81  .1uF  [CAPC0805(2012)75_M]
C82  0.1uF  [CAPC0402(1005)60_L]
C83  0.1uF  [CAPC0402(1005)60_L]
C84  0.1uF  [CAPC0402(1005)60_L]
C85  0.1uF  [CAPC0402(1005)60_L]
C86  1uF  [CAPC0402(1005)60_L]
J1  FCS8-10-01-X-S-A  [FCS8-10-01-X-S-A]
R70  value 10k  [RESC0402(1005)_M]  (hidden comment: 10k 1% 0402(1005))
R71  value 100k  [RESC0402(1005)_M]  (hidden comment: 100k 1% 0402(1005))
R72  value 100  [RESC0402(1005)_M]  (hidden comment: 100 1% 0402(1005))
R73  value 10k  [RESC0402(1005)_M]  (hidden comment: 10k 1% 0402(1005))
R74  value 100k  [RESC0402(1005)_M]  (hidden comment: 100k 1% 0402(1005))
R75  4.75K  [RESC0805(2012)_L]
R76  value 100  [RESC0402(1005)_M]  (hidden comment: 100 1% 0402(1005))
R77  (no value)  [RESC0402(1005)_M]
R78  100  [RESC0402(1005)_M]
R79  (no value)  [RESC0402(1005)_M]
R80  (no value)  [RESC0402(1005)_M]
R81  (no value)  [RESC0402(1005)_M]
R82  (no value)  [RESC0402(1005)_M]
R83  (no value)  [RESC0402(1005)_M]
R84  value 100k  [RESC0402(1005)_M]  (hidden comment: 100k 1% 0402(1005))
R85  value 100k  [RESC0402(1005)_M]  (hidden comment: 100k 1% 0402(1005))
R86  value 100k  [RESC0402(1005)_M]  (hidden comment: 100k 1% 0402(1005))
R87  value 100k  [RESC0402(1005)_M]  (hidden comment: 100k 1% 0402(1005))
U34  MAX333CWP+  [TSOP65P640X90-20N]
U35  LTC2057HVIS8PBF  [*SO-8_S]
U36  LTC2057HVIS8PBF  [*SO-8_S]
U37  LMC662CM  [D0008A_M]  (parts A,B of 2)
U38  OPA188AIDBVR  [DBV0005A_M]
U39  OPA188AIDBVR  [DBV0005A_M]

### Ports
Beam, Bottom In (bidir), Bottom Sense Plate Force, Bottom Sense Plate Sense, PA4, PB1, PE13, Top In (bidir), Top Sense Plate Force, Top Sense Plate Sense

### Nets
+3.3: U38.5(V+) U39.5(V+)
+5: C80.2 C82.2 U34.16(V+) U37.8(V+)
-5: C85.2 U37.4(V-)
GND: C79.2 C80.1 C81.1 C82.1 C85.1 C86.1 R70.1 R73.1 R75.2 R81.2 R82.2 R83.1 R85.1 R87.1 U34.1(IN1) U34.2(NO1) U34.3(COM1) U34.4(NC1) U34.5(V-) U34.6(GND) U34.7(NC2) U34.8(COM2) U34.9(NO2) U34.10(IN2) U34.14(NC3) U34.19(NO4) U35.4(V-) U35.8(SDCOM) U36.4(V-) U36.8(SDCOM) U38.2(V-) U39.2(V-)
Guard: J1.9 J1.11 J1.12 J1.13 J1.14 R78.2
ZSupply: C79.1 C81.2 U35.1(*SD) U35.7(V+) U36.1(*SD) U36.7(V+)
BEAM: C83.2 R81.1 ; port Beam
Beam_In: J1.10 R83.2 U37.5(INB+)
Bottom Force Plate Force: J1.4 R76.2 R86.2
Bottom Force Plate Sense: J1.3 R74.2
Bottom In: U34.12(NO3) ; port Bottom In
Bottom Sense Plate Force: J1.7 ; port Bottom Sense Plate Force
Bottom Sense Plate Sense: J1.8 ; port Bottom Sense Plate Sense
PA4: U38.1(OUT) U38.4(IN-) ; port PA4
PB1: U39.1(OUT) U39.4(IN-) ; port PB1
PE13: R75.1 U34.11(IN3) U34.20(IN4) ; port PE13
Top Force Plate Force: J1.2 R72.2 R84.2
Top Force Plate Sense: J1.1 R71.2
Top In: U34.17(NC4) ; port Top In
Top Sense Plate Force: J1.5 ; port Top Sense Plate Force
Top Sense Plate Sense: J1.6 ; port Top Sense Plate Sense
NetC83_1: C83.1 R79.1
NetC84_1: C84.1 R78.1 U37.6(INB-) U37.7(OUTB)
NetC84_2: C84.2 R82.1 U37.3(INA+)
NetC86_2: C86.2 R80.2
NetR70_2: R70.2 R71.1 U35.2(-IN)
NetR72_1: R72.1 U35.6(OUT)
NetR73_2: R73.2 R74.1 U36.2(-IN)
NetR76_1: R76.1 U36.6(OUT)
NetR77_1: R77.1 R79.2 R80.1 U37.1(OUTA)
NetR77_2: R77.2 U37.2(INA-)
NetR84_1: R84.1 R85.2 U38.3(IN+)
NetR86_1: R86.1 R87.2 U39.3(IN+)
NetU34_13: U34.13(COM3) U36.3(+IN)
NetU34_18: U34.18(COM4) U35.3(+IN)

Not connected (* = marked no-connect by the designer): U34 15(N.C.)*; U35 5(NC)*; U36 5(NC)*

### Notes on the sheet
- LTC2057HV 60V - Zero drift
- ADA4522-2 55V
- (near U34) PWM125Hz
- Title
- Size:
- Date:
- Tabloid
- Number:
- Time:
- Revision:
- Sheet
- of
- File:

### Library data of the parts
C79 C81 = CMP-1036-01414-1: CAP 33pF 25V ±2% 0805 (2012 Metric) Thickness 0.75mm SMD; Tolerance: Â±2%; Case-Metric: 2012; Case-EIA: 0805; Value: .1uF; Max Thickness: 0.75 mm; Rated Voltage: 25 V; Technology: SMT
C80 = CMP-1036-02117-1: CAP 150pF 16V ±10% 0805 (2012 Metric) Thickness 0.75mm SMD; Case-EIA: 0805; Tolerance: Â±10%; Case-Metric: 2012; Technology: SMT; Max Thickness: 0.75 mm; Rated Voltage: 16 V; Value: .1uF
C82-C86 = CMP-1034-00252-1: CAP CER 0.1UF 10V X7R 0402; Manufacturer: Murata Electronics North America; Manufacturer Part Number: GRM155R71A104KA01D; Tolerance: ±10%; Supplier 1: Digi-Key; Supplier Part Number 1: 490-6321-1-ND; RoHS: RoHS Compliant; Category: Capacitors; Stock 1: 2920395; Pricing 1: 1=0.1, 10=0.014, 100=0.0063, 500=0.00446, 1000=0.00351, 2500=0.00319, 5000=0.00293 (USD); Packaging: Cut Tape (CT); Part Status: Active; Voltage - Rated: 10V; Temperature Coefficient: X7R; Operating Temperature: -55°C ~ 125°C; Features: -; Ratings: -; Applications: General Purpose; Mounting Type: Surface Mount, MLCC; Package / Case: 0402 (1005 Metric); Size / Dimension: 0.039" L x 0.020" W (1.00mm x 0.50mm); Height - Seated (Max): -; Thickness (Max): 0.022" (0.55mm); Lead Spacing: -; ComponentLink1URL: http://www.murata.com/~/media/webrenewal/support/library/catalog/products/capacitor/mlcc/c02e.ashx?la=en-us; ComponentLink1Description: http://www.murata.com/~/media/webrenewal/support/library/catalog/products/capacitor/mlcc/c02e.ashx?la=en-us
J1 = FCS8-10-01-X-S-A: FCS8 Socket Assembly, 20-Pins, w/ Alignment Pins; MANUFACTURER: SAMTEC; CREATED: 31 NOV 2013 - WENDY XIN; PCB DECAL: FCS8-10-01-X-S-A
R70 R73 = CMP-1011-00940-1: 10k 0.063W 1% 0402 (1005 Metric)  SMD; Case-Metric: 1005; Case-EIA: 0402; Power: 0.063 W; Technology: SMT; Tolerance: 1 %
R71 R74 R84-R87 = CMP-1011-00940-1: 100k 0.063W 1% 0402 (1005 Metric)  SMD; Case-Metric: 1005; Case-EIA: 0402; Power: 0.063 W; Technology: SMT; Tolerance: 1 %
R72 R76 = CMP-1011-00940-1: 6M34 0.063W 1% 0402 (1005 Metric)  SMD; Case-Metric: 1005; Case-EIA: 0402; Power: 0.063 W; Technology: SMT; Tolerance: 1 %
R75 = CMP-1013-00215-1: 2R55 0.125W 1% 0805 (2012 Metric)  SMD; Case-Metric: 2012; Value: 47k; Case-EIA: 0805; Tolerance: 1 %; Technology: SMT; Power: 0.125 W
R77-R83 = CMP-1011-00463-1
U34 = MAX333CWP+: IC SWITCH QUAD SPDT 20TSSOP; Manufacturer: Maxim; Manufacturer Part Number: MAX333AEUP+; Max Supply Voltage: 30V; Min Supply Voltage: 10V; Min Dual Supply Voltage: 4.5V; Max Dual Supply Voltage: 20V; On-State Resistance: 35R; Operating Supply Current: 1uA; Supply Type: Single,Dual; Max Power Dissipation: 559mW; Turn-On Delay Time: 175ns; Turn-Off Delay Time: 145ns; Max Supply Current: 250uA; Number of Bits: 4; Dual Supply Voltage: 15V; Supplier 1: Mouser; Supplier Part Number 1: 700-MAX333AEUP; Stock 1: 664; Pricing 1: 1=6.77, 10=6.43, 50=5.8, 100=5.8, 1000=5.62, 10000=5.62 (USD); Case/Package: TSSOP; Number of Pins: 20; Weight: 0.006737oz; Min Operating Temperature: -40°C; Max Operating Temperature: 85°C; Packaging: Rail/Tube; Package Quantity: 74; Throw Configuration: SPDT; Number of Channels: 4; Length: 6.6mm; Height: 0.95mm; Width: 4.5mm; Radiation Hardening: No; Lead Free: Lead Free; REACH SVHC: Unknown; ComponentLink1URL: https://datasheet.ciiva.com/2978/max333a-2978850.pdf; ComponentLink1Description: https://datasheet.ciiva.com/2978/max333a-2978850.pdf; ComponentLink2URL: https://datasheet.ciiva.com/30478/0900766b81253c85-30478260.pdf; ComponentLink2Description: https://datasheet.ciiva.com/30478/0900766b81253c85-30478260.pdf; ComponentLink3URL: https://datasheet.ciiva.com/1674/max333a-1674617.pdf; ComponentLink3Description: https://datasheet.ciiva.com/1674/max333a-1674617.pdf; ComponentLink4URL: https://datasheet.ciiva.com/26825/max333aeup-26825546.pdf; ComponentLink4Description: https://datasheet.ciiva.com/26825/max333aeup-26825546.pdf
U35 U36 = LTC2057HVIS8PBF: LTC2057/LTC2057HV - High Voltage, Low Noise Zero-Drift Operational Amplifier; Manufacturer: Analog Devices / Linear Technology; MF: Linear Technology/Analog; MP: LTC2057HVIS8#PBF; Number of Channels: 1; Common Mode Rejection Ratio: 128dB; Unity Gain Bandwidth Product: 1.5MHz; Max Supply Voltage: 60V; Min Supply Voltage: 4.75V; Slew Rate: 0.45V/µs; Input Bias Current: 30pA; Input Offset Voltage (Vos): 0.5uV; Operating Supply Current: 900uA; Output Current per Channel: 30mA; Voltage Gain: 150dB; Digi-Key_Part_Number: LTC2057HVIS8#PBF-ND; SnapEDA_Link: https://www.snapeda.com/parts/LTC2057HVIS8%23PBF/Analog%20Devices/view-part/?ref=snap; Package: SO-8 Linear Technology; Digi-Key_Purchase_URL: https://www.digikey.com/product-detail/en/linear-technology-analog-devices/LTC2057HVIS8-PBF/LTC2057HVIS8-PBF-ND/4156547?utm_source=snapeda&utm_medium=aggregator&utm_campaign=symbol; Value: *; Supplier 1: Mouser; Supplier Part Number 1: 584-LTC2057HVIS8#PBF; Manufacturer Part Number: LTC2057HVIS8#PBF; Stock 1: 880; Pricing 1: 1=5.30000, 10=5.30000, 25=3.51000, 50=3.51000, 100=2.90000, 250=2.76000, 500=2.70000, 1000=2.59000, 10000=2.59000 (USD); RoHS: Yes; Mount: Surface Mount; Case/Package: SOIC; Number of Pins: 8; Min Operating Temperature: -40°C; Max Operating Temperature: 85°C; Bandwidth: 1.5MHz; Package Quantity: 100; Packaging: Rail/Tube; Number of Circuits: 1; Gain Bandwidth Product: 1.5MHz; Number of Elements: 1; Number of Amplifiers: 1; REACH SVHC: No SVHC; ComponentLink1URL: https://datasheet.ciiva.com/18622/43236-18622326.pdf?src-supplier=Digi-Key; ComponentLink1Description: https://datasheet.ciiva.com/18622/43236-18622326.pdf?src-supplier=Digi-Key; ComponentLink2URL: https://datasheet.ciiva.com/22733/1761439-22733480.pdf?src-supplier=Element14; ComponentLink2Description: https://datasheet.ciiva.com/22733/1761439-22733480.pdf?src-supplier=Element14; ComponentLink3URL: https://datasheet.ciiva.com/25651/1761439-25651631.pdf?src-supplier=Farnell; ComponentLink3Description: https://datasheet.ciiva.com/25651/1761439-25651631.pdf?src-supplier=Farnell
U37 = CMP-0055-00893-3: CMOS Dual Operational Amplifier, 8-pin Narrow SOIC; Manufacturer: Texas Instruments; PowerWise: N; CompType: Amplifiers; PackageTopMarking: NSZXTT*LMC66*2CM; RoHS: N; ComponentLink1Description: Datasheet URL; PinCount: 8; Code_IPC: SOIC127P600-8; ComponentLink1URL: http://www.ti.com/general/docs/lit/getliterature.tsp?genericPartNumber=LMC662&fileType=pdf; Code_JEDEC: MS-012-AA; PackageDescription: SOIC Narrow, 4.9 x 3.9 x 1.45mm, 8 Lead, 1.27mm Pitch; Package Reference: D0008A; PartId: 1
U38 U39 = CMP-0809-00005-2: Precision, Low Noise, Rail-to-Rail Output, Zero-Drift Operational Amplifier, 4 to 36 V, -40 to 125 degC, 5-pin SOT23 (DBV5), Green (RoHS & no Sb/Br); Manufacturer: Texas Instruments; Total Supply Voltage(Min)(+5V is 5, +/-5V is 10): 4; Offset Drift(Typ)(uV/C): 0.03; Rating: Catalog; SubFamily: Zero Drift Precision Amplifier; GBW(Typ)(MHz): 2; Slew Rate(Typ)(V/us): 0.8; Number of Channels: 1; CMRR(Min)(dB): 120; Iq per channel(Max)(mA): 0.51; Total Supply Voltage(Max)(+5V is 5, +/-5V is 10): 36; PartNumber: OPA188AIDBVR; ComponentLink2Description: Datasheet; ComponentLink2URL: http://www.ti.com/lit/ds/symlink/opa188.pdf; ComponentLink1Description: Manufacturer URL; Mounting Technology: Surface Mount; Eco-Plan: Green (RoHS & no Sb/Br); ComponentLink1URL: http://www.ti.com/; PackageVersion: 4073253-4/K, 03/2006; DatasheetVersion: SBOS642A; ComponentLink3Description: Package Specification; PackageReference: DBV0005A; ComponentLink3URL: http://www.ti.com/litv/pdf/mpds018i; PackageDescription: 5-Pin Plastic Small Outline, Body 1.6 x 2.9 mm, Pitch 0.95 mm; Code_JEDEC: MO-178